# Altium schematic sheet SubBus5.SchDoc
size A
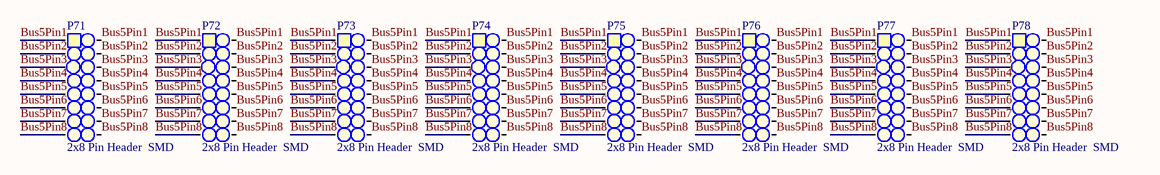
[diagram p0: SubBus5.SchDoc]

## Parts
P71  2x8 Pin Header  SMD  [2X8_SMD_PH_2.54]
P72  2x8 Pin Header  SMD  [2X8_SMD_PH_2.54]
P73  2x8 Pin Header  SMD  [2X8_SMD_PH_2.54]
P74  2x8 Pin Header  SMD  [2X8_SMD_PH_2.54]
P75  2x8 Pin Header  SMD  [2X8_SMD_PH_2.54]
P76  2x8 Pin Header  SMD  [2X8_SMD_PH_2.54]
P77  2x8 Pin Header  SMD  [2X8_SMD_PH_2.54]
P78  2x8 Pin Header  SMD  [2X8_SMD_PH_2.54]

## Nets
Bus5Pin1: P71.1 P71.16 P72.1 P72.16 P73.1 P73.16 P74.1 P74.16 P75.1 P75.16 P76.1 P76.16 P77.1 P77.16 P78.1 P78.16
Bus5Pin2: P71.2 P71.15 P72.2 P72.15 P73.2 P73.15 P74.2 P74.15 P75.2 P75.15 P76.2 P76.15 P77.2 P77.15 P78.2 P78.15
Bus5Pin3: P71.3 P71.14 P72.3 P72.14 P73.3 P73.14 P74.3 P74.14 P75.3 P75.14 P76.3 P76.14 P77.3 P77.14 P78.3 P78.14
Bus5Pin4: P71.4 P71.13 P72.4 P72.13 P73.4 P73.13 P74.4 P74.13 P75.4 P75.13 P76.4 P76.13 P77.4 P77.13 P78.4 P78.13
Bus5Pin5: P71.5 P71.12 P72.5 P72.12 P73.5 P73.12 P74.5 P74.12 P75.5 P75.12 P76.5 P76.12 P77.5 P77.12 P78.5 P78.12
Bus5Pin6: P71.6 P71.11 P72.6 P72.11 P73.6 P73.11 P74.6 P74.11 P75.6 P75.11 P76.6 P76.11 P77.6 P77.11 P78.6 P78.11
Bus5Pin7: P71.7 P71.10 P72.7 P72.10 P73.7 P73.10 P74.7 P74.10 P75.7 P75.10 P76.7 P76.10 P77.7 P77.10 P78.7 P78.10
Bus5Pin8: P71.8 P71.9 P72.8 P72.9 P73.8 P73.9 P74.8 P74.9 P75.8 P75.9 P76.8 P76.9 P77.8 P77.9 P78.8 P78.9

## Library data of the parts
P71-P78 = 2x8 Pin Header  SMD: 2.54mm, SMD; Value: 2x8 Pin Header, 2.54mm, SMD; Farnell: 2356242